# Altium schematic sheet Charger Interface - Relay Controls.SchDoc
size A4
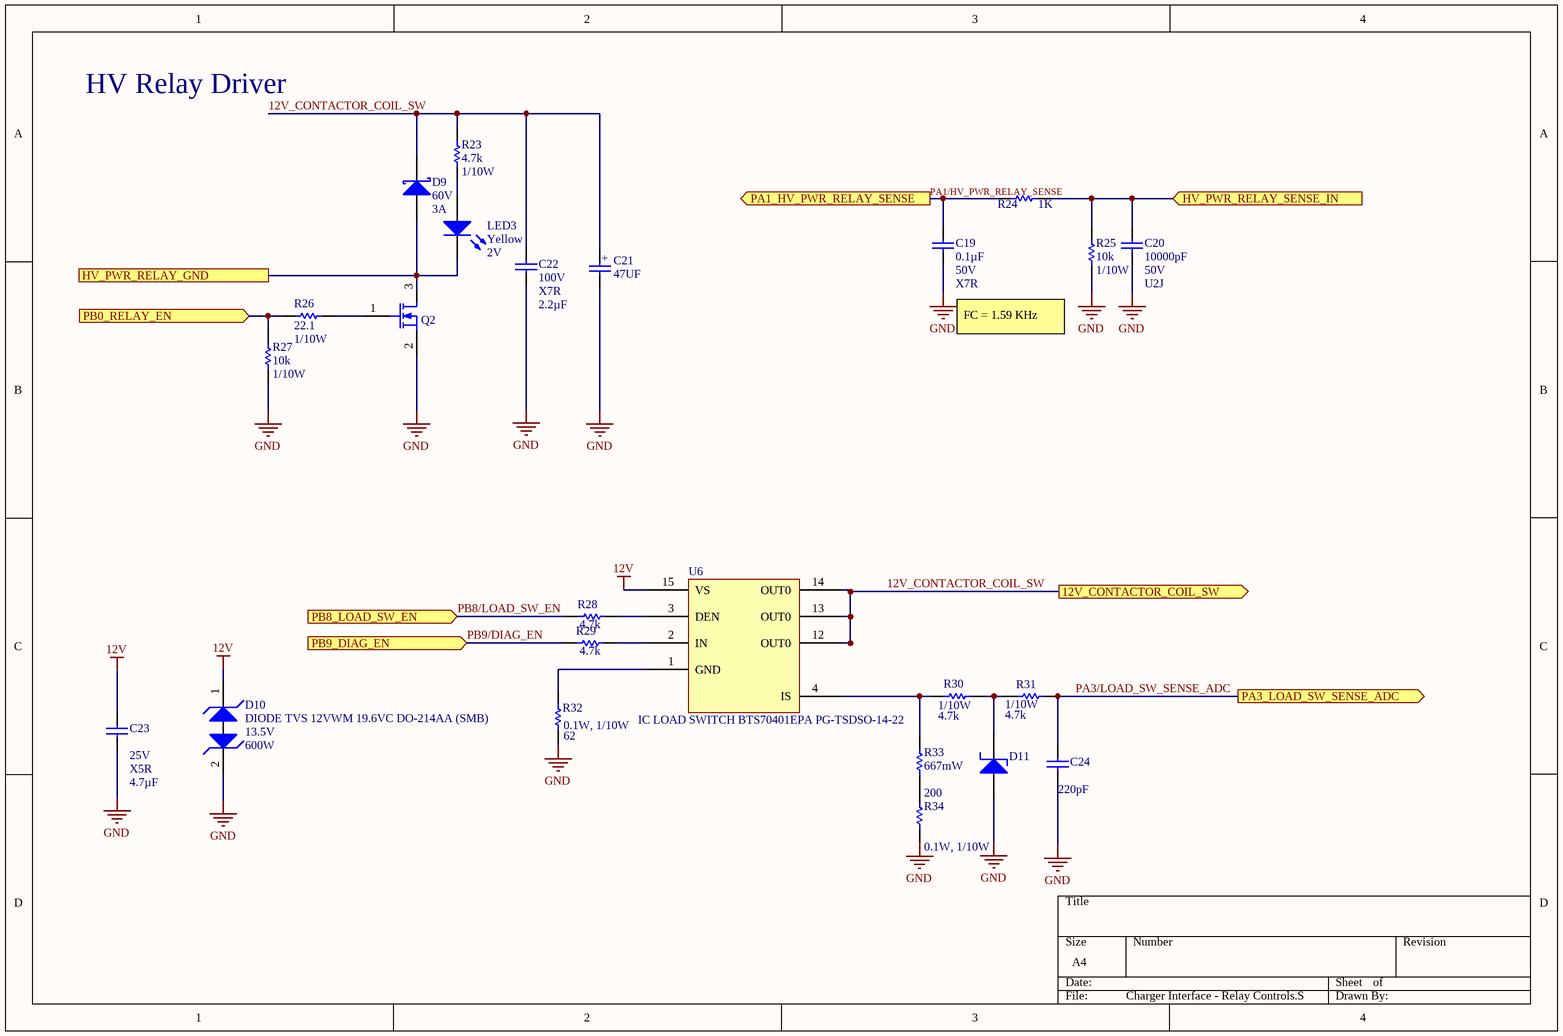
[diagram p0: Charger Interface - Relay Controls.SchDoc]

## Parts
C19  Capacitance: 0.1µF  Voltage: 50V  Temperature Coefficient: X7R  [CAP, 0603]  (hidden comment: CAP CER 0.1UF 50V 10% X7R 0603)
C20  Capacitance: 10000pF  Voltage: 50V  Temperature Coefficient: U2J  [CAP, 0603]  (hidden comment: CAP CER 10nF 50V 5% X7R 0603)
C21  47UF  [CAP ALUM 6.3MM RADIAL SMD]
C22  value 2.2µF  Voltage: 100V  Temperature Coefficient: X7R  [CAP, 1206]  (hidden comment: CAP CER 2.2UF 100V ±20% X7R 1206)
C23  value 4.7µF  Voltage: 25V  Temperature Coefficient: X5R  [CAP, 0603]  (hidden comment: CAP CER 4.7UF 25V 10% X5R 0603)
C24  value 220pF  [CAP, 0603]  (hidden comment: CAP CER 220PF 50V C0G/NP0 0603)
D9  Voltage - DC Reverse (Vr) (Max): 60V  Current - Average Rectified (Io): 3A  [Diode, SMA]  (hidden comment: DIODE SCHOTTKY 60V 3A SMA)
D10  DIODE TVS 12VWM 19.6VC DO-214AA (SMB)  Voltage - Breakdown (Min): 13.5V  Power - Peak Pulse: 600W  [DO-214AA Diode]
D11  DIODE ZENER 3.3V 200MW SOD323  [sod-323]  (value not drawn)
LED3  Color: Yellow  Voltage - Forward (Vf) (Typ): 2V  [LED_0603]  (hidden comment: LED YELLOW CLEAR 2.1V 0603)
Q2  MOSFET N-CH 30V 6.2A 0.9W SOT-23  [MOSFET N-CH 30V 6.2A 0.9W SOT-23]  (value not drawn)
R23  Resistance (Ohms): 4.7k  Power (Watts): 1/10W  [RES, 0603]  (hidden comment: RES 4.7K OHM 1% 1/10W 0603)
R24  1K  [RES, 0603]
R25  Resistance: 10k  Power: 1/10W  [RES, 0603]  (hidden comment: RES 10K OHM 1% 1/10W 0603)
R26  Resistance: 22.1  Power: 1/10W  [RES, 0603]  (hidden comment: RES 22.1 OHM 1% 1/10W 0603)
R27  Resistance: 10k  Power: 1/10W  [RES, 0603]  (hidden comment: RES 10K OHM 1% 1/10W 0603)
R28  Resistance (Ohms): 4.7k  [RES, 0603]  (hidden comment: RES 4.7K OHM 1% 1/10W 0603)
R29  Resistance (Ohms): 4.7k  [RES, 0603]  (hidden comment: RES 4.7K OHM 1% 1/10W 0603)
R30  Resistance (Ohms): 4.7k  Power (Watts): 1/10W  [RES, 0603]  (hidden comment: RES 4.7K OHM 1% 1/10W 0603)
R31  Resistance (Ohms): 4.7k  Power (Watts): 1/10W  [RES, 0603]  (hidden comment: RES 4.7K OHM 1% 1/10W 0603)
R32  value 62  Power (Watts): 0.1W, 1/10W  [RES, 0603]  (hidden comment: RES 62 OHM 0.1% 1/10W 0603)
R33  value 200  Max Power Dissipation: 667mW  [RES 1206]  (hidden comment: RES 200 OHM 5% 2/3W 1206)
R34  Power (Watts): 0.1W, 1/10W  [RES, 0603]  (hidden comment: RES 1K OHM 5% 1/10W 0603)
U6  IC LOAD SWITCH BTS70401EPA PG-TSDSO-14-22  [IC LOAD SWITCH PG-TSDSO-14-22]

## Ports
12V_CONTACTOR_COIL_SW (out), HV_PWR_RELAY_GND, HV_PWR_RELAY_SENSE_IN (in), PA1_HV_PWR_RELAY_SENSE (out), PA3_LOAD_SW_SENSE_ADC (out), PB0_RELAY_EN (in), PB8_LOAD_SW_EN (in), PB9_DIAG_EN (in)

## Nets
12V: C23.1 D10.1(Cathode1) U6.15(VS)
GND: C19.2 C20.2 C21.2 C22.2 C23.2 C24.2 D10.2(Cathode2) D11.1(A) Q2.2(S) R25.2 R27.2 R32.2 R34.2
12V_CONTACTOR_COIL_SW: C21.1 C22.1 D9.2 R23.1 U6.12(OUT0) U6.13(OUT0) U6.14(OUT0) ; port 12V_CONTACTOR_COIL_SW
HV_PWR_RELAY_GND: D9.1 LED3.2(K) Q2.3(D) ; port HV_PWR_RELAY_GND
HV_PWR_RELAY_SENSE_IN: C20.1 R24.2 R25.1 ; port HV_PWR_RELAY_SENSE_IN
PA1/HV_PWR_RELAY_SENSE: C19.1 R24.1 ; port PA1_HV_PWR_RELAY_SENSE
PA3/LOAD_SW_SENSE_ADC: C24.1 R31.2 ; port PA3_LOAD_SW_SENSE_ADC
PB0_RELAY_EN: R26.1 R27.1 ; port PB0_RELAY_EN
PB8/LOAD_SW_EN: R28.2 ; port PB8_LOAD_SW_EN
PB9/DIAG_EN: R29.2 ; port PB9_DIAG_EN
NetD11_2: D11.2(K) R30.2 R31.1
NetLED3_1: LED3.1(A) R23.2
NetQ2_1: Q2.1(G) R26.2
NetR28_1: R28.1 U6.3(DEN)
NetR29_1: R29.1 U6.2(IN)
NetR30_1: R30.1 R33.1 U6.4(IS)
NetR32_1: R32.1 U6.1(GND)
NetR33_2: R33.2 R34.1

## Notes on the sheet
- HV Relay Driver
- FC = 1.59 KHz
- (in symbol CAP ALUM 47UF 20% 35V SMD) +

## Library data of the parts
C19 = CAP CER 0.1UF 50V 10% X7R 0603: 0.10µF ±10% 50V Ceramic Capacitor X7R 0603 (1608 Metric); Manufacturer 1: AVX Corporation; Manufacturer Part Number 1: 06035C104KAT2A; Supplier 1: Digi-Key; Supplier Part Number 1: 478-5052-1-ND; Packaging: Cut Tape (CT); Part Status: Active; Operating Temperature: -55°C ~ 125°C; Ratings: -; Mounting Type: Surface Mount, MLCC; Package / Case: 0603 (1608 Metric); Size / Dimension: 0.063" L x 0.032" W (1.60mm x 0.81mm); Height - Seated (Max): -; Thickness (Max): 0.035" (0.90mm); Lead Spacing: -; Lead Style: -; ComponentLink1URL: http://datasheets.avx.com/X7RDielectric.pdf; ComponentLink1Description: http://datasheets.avx.com/X7RDielectric.pdf; Tolerance: ±10%
C20 = CAP CER 10nF 50V 5% X7R 0603: 10000pF ±5% 50V Ceramic Capacitor U2J 0603 (1608 Metric); Manufacturer 1: KEMET; Manufacturer Part Number 1: C0603C103J5JAC7867; Supplier 1: Digi-Key; Supplier Part Number 1: 399-13384-1-ND; Packaging: Cut Tape (CT); Part Status: Active; Operating Temperature: -55°C ~ 125°C; Ratings: -; Failure Rate: -; Mounting Type: Surface Mount, MLCC; Package / Case: 0603 (1608 Metric); Size / Dimension: 0.063" L x 0.032" W (1.60mm x 0.80mm); Height - Seated (Max): -; Thickness (Max): 0.034" (0.87mm); Lead Spacing: -; Lead Style: -; ComponentLink1URL: http://www.kemet.com/docfinder?Partnumber=C0603C103J5JAC7867; ComponentLink1Description: http://www.kemet.com/docfinder?Partnumber=C0603C103J5JAC7867; Tolerance: ±5%
C21 = CAP ALUM 47UF 20% 35V SMD: 47µF 35V Aluminum Electrolytic Capacitors Radial, Can - SMD 1000 Hrs @ 85°C; Manufacturer: Panasonic; Manufacturer Part Number: EEE-1VA470WP; Ripple Current: 70mA; Tolerance: 20%; Life (Hours): 1000Hour; Supplier 1: Digi-Key; Stock 1: 2820; Pricing 1: 1=0.38, 10=0.263, 100=0.1579, 500=0.11846 (USD); Mount: Surface Mount,PCB; Case/Package: Radial; Min Operating Temperature: -40°C; Max Operating Temperature: 85°C; Voltage Rating: 35V; Ripple Current (AC): 70mA; Packaging: Tape and Reel; Package Quantity: 1; Termination: SMD/SMT; Diameter: 6.3mm; Length: 5.5mm; Height: 5.4mm; Height - Seated (Max): 0.213inch; Radiation Hardening: No; REACH SVHC: Unknown; Lead Free: Lead Free; ComponentLink1URL: https://datasheet.ciiva.com/2983/aba0000ce2-2983926.pdf; ComponentLink1Description: https://datasheet.ciiva.com/2983/aba0000ce2-2983926.pdf; ComponentLink2URL: https://datasheet.ciiva.com/2983/aba0000ce2-2983927.pdf; ComponentLink2Description: https://datasheet.ciiva.com/2983/aba0000ce2-2983927.pdf; ComponentLink3URL: https://datasheet.ciiva.com/14598/70255710-14598937.pdf; ComponentLink3Description: https://datasheet.ciiva.com/14598/70255710-14598937.pdf; ComponentLink4URL: https://datasheet.ciiva.com/15165/getdatasheetpartid-86239-15165868.pdf; ComponentLink4Description: https://datasheet.ciiva.com/15165/getdatasheetpartid-86239-15165868.pdf; ComponentLink5URL: https://datasheet.ciiva.com/16507/aba0000ce2-16507965.pdf; ComponentLink5Description: https://datasheet.ciiva.com/16507/aba0000ce2-16507965.pdf; ComponentLink6URL: https://datasheet.ciiva.com/30206/11aba0000ce2-30206253.pdf; ComponentLink6Description: https://datasheet.ciiva.com/30206/11aba0000ce2-30206253.pdf; Capacitance: 47uF; Voltage Rating (DC): 35V; Contact Plating: Tin
C22 = CMP-013-0032-1: 2.2µF ±20% 100V Ceramic Capacitor X7R 1206 (3216 Metric); Manufacturer 1: Murata Electronics North America; Manufacturer Part Number 1: GRM31CR72A225MA73L; ComponentLink1URL: http://www.murata.com/~/media/webrenewal/support/library/catalog/products/capacitor/mlcc/c02e.ashx; Thickness (Max): 0.071" (1.80mm); Design Item ID: CAP CER 2.2UF 100V ±20% X7R 1206; Lead Spacing: -; Height - Seated (Max): -; Source: Schematic Diagrams.SchLib; Mounting Type: Surface Mount, MLCC; Tolerance: 20%; Package / Case: 1206 (3216 Metric); Operating Temperature: -55°C ~ 125°C; Lead Style: -; Ratings: -; Packaging: Cut Tape (CT); Part Status: Active; ComponentLink1Description: http://www.murata.com/~/media/webrenewal/support/library/catalog/products/capacitor/mlcc/c02e.ashx; Size / Dimension: 0.126" L x 0.063" W (3.20mm x 1.60mm)
C23 = CMP-013-0026-1: 4.7µF ±10% 25V Ceramic Capacitor X5R 0603 (1608 Metric); Manufacturer 1: Murata Electronics North America; Manufacturer Part Number 1: GRM188R61E475KE11D; Packaging: Cut Tape (CT); Thickness (Max): 0.031" (0.80mm); Size / Dimension: 0.063" L x 0.031" W (1.60mm x 0.80mm); ComponentLink1URL: http://www.murata.com/~/media/webrenewal/support/library/catalog/products/capacitor/mlcc/c02e.ashx; Height - Seated (Max): -; Tolerance: 10%; Package / Case: 0603 (1608 Metric); Operating Temperature: -55°C ~ 85°C; Part Status: Active; ComponentLink1Description: http://www.murata.com/~/media/webrenewal/support/library/catalog/products/capacitor/mlcc/c02e.ashx; Mounting Type: Surface Mount, MLCC; Design Item ID: CAP CER 4.7UF 25V 10% X5R 0603; Ratings: -; Lead Style: -; Source: Schematic Diagrams.SchLib; Lead Spacing: -
C24 = CMP-013-0062-1: 220pF ±5% 50V Ceramic Capacitor C0G, NP0 0603 (1608 Metric); Manufacturer Part Number: C0603C221J5GACAUTO; Manufacturer: KEMET; Dissipation Factor: 0.1%; Design Item ID: CAP CER 220PF 50V C0G/NP0 0603; REACH SVHC: No SVHC; Height: 0.8mm; ComponentLink2Description: https://datasheet.ciiva.com/22694/1633156-22694015.pdf?src-supplier=Element14; Max Operating Temperature: 125°C; Mount: Surface Mount; Voltage Rating: 50V; Contact Plating: Tin; Pricing 1: 1=0.14000, 10=0.09700, 100=0.04550, 500=0.03188, 1000=0.02640 (USD); Stock 1: 35170; Case/Package: 0603; Tolerance: 5%; Ratings: AEC-Q200; ComponentLink1Description: https://datasheet.ciiva.com/18192/getdatasheetpartid-416741-18192869.pdf?src-supplier=Verical; Voltage Rating (DC): 50V; ComponentLink1URL: https://datasheet.ciiva.com/18192/getdatasheetpartid-416741-18192869.pdf?src-supplier=Verical; Package Quantity: 1; Thickness: 0.034inch; Length: 1.6mm; Radiation Hardening: No; Depth: 0.8mm; Width: 0.031inch; Packaging: Tape and Reel; RoHS: Yes; Lead Free: Lead Free; ComponentLink2URL: https://datasheet.ciiva.com/22694/1633156-22694015.pdf?src-supplier=Element14; Termination: SMD/SMT; Min Operating Temperature: -55°C; Dielectric: C0G; Dielectric Material: Ceramic; Source: Schematic Diagrams.SchLib; Case Code (Metric): 1608
D9 = DIODE SCHOTTKY 60V 3A SMA: Diode Schottky 60V 3A Surface Mount SMA; Manufacturer 1: Diodes Incorporated; Manufacturer Part Number 1: B360A-13-F; Voltage - Forward (Vf) (Max) @ If: 700mV @ 3A; Speed: Fast Recovery =< 500ns, > 200mA (Io); Current - Reverse Leakage @ Vr: 500µA @ 60V; Capacitance @ Vr, F: 200pF @ 4V, 1MHz; Supplier 1: Digi-Key; Supplier Part Number 1: B360A-FDICT-ND; Packaging: Cut Tape (CT); Part Status: Active; Diode Type: Schottky; Mounting Type: Surface Mount; Package / Case: DO-214AC, SMA; Supplier Device Package: SMA; Operating Temperature - Junction: -55°C ~ 150°C; ComponentLink1URL: https://www.diodes.com/assets/Datasheets/ds30891.pdf; ComponentLink1Description: https://www.diodes.com/assets/Datasheets/ds30891.pdf
D10 = CMP-014-0012-1: TVS DIODE 12V 19.6V DO214AA; Manufacturer Part Number: SMBJ12CD-M3/H; Manufacturer: Vishay Semiconductor Diodes Division; Current - Peak Pulse (10/1000µs): 30.6A; Power Line Protection: No; Stock 1: 4469; Mounting Type: Surface Mount; Applications: General Purpose; RoHS: RoHS Compliant; ComponentLink1URL: http://www.vishay.com/docs/87606/87606.pdf; Voltage - Reverse Standoff (Typ): 12V; Supplier Device Package: DO-214AA (SMBJ); Voltage - Clamping (Max) @ Ipp: 19.6V; Part Status: Active; Source: Schematic Diagrams.SchLib; Packaging: Cut Tape (CT); Design Item ID: DIODE TVS 12VWM 19.6VC DO-214AA (SMB); Operating Temperature: -55°C ~ 150°C (TJ); ComponentLink1Description: http://www.vishay.com/docs/87606/87606.pdf; Capacitance @ Frequency: -; Pricing 1: 1=0.69, 10=0.565, 25=0.516, 100=0.3841, 250=0.34808 (CAD); Package / Case: DO-214AA, SMB
D11 = CMP-014-0022-1: Zener Diode 3.3V 200mW ±5% Surface Mount SOD-323; Voltage: 3.3V; Source: Schematic Diagrams.SchLib; ComponentLink1URL: http://www.vishay.com/docs/85764/bzx384.pdf; Design Item ID: DIODE ZENER 3.3V 200MW SOD323; ComponentLink1Description: http://www.vishay.com/docs/85764/bzx384.pdf
LED3 = LED YELLOW CLEAR 2.1V 0603: Yellow 590nm LED Indication - Discrete 2V 0603 (1608 Metric); Manufacturer: Wurth Electronics Inc.; Manufacturer Part Number: 150060YS75000; Lens Color: Colorless; Millicandela Rating: 120mcd; Lens Style/Size: Rectangle with Flat Top, 1.10mm x 0.70mm; Current - Test: 20mA; Viewing Angle: 140°; Wavelength - Peak: 595nm; Supplier 1: Digi-Key; RoHS: RoHS Compliant; Category: Optoelectronics; Stock 1: 10523; Pricing 1: 1=0.21, 100=0.1617, 500=0.13964 (CAD); Packaging: Cut Tape (CT); Part Status: Active; Lens Transparency: Clear; Mounting Type: Surface Mount; Wavelength - Dominant: 590nm; Features: -; Package / Case: 0603 (1608 Metric); Supplier Device Package: 0603; Size / Dimension: 1.60mm L x 0.80mm W; Height (Max): 0.80mm; ComponentLink1URL: http://katalog.we-online.de/led/datasheet/150060YS75000.pdf; ComponentLink1Description: http://katalog.we-online.de/led/datasheet/150060YS75000.pdf; Supplier Part Number 1: 732-4981-1-ND
Q2 = MOSFET N-CH 30V 6.2A 0.9W SOT-23: N-Channel 30V 6.2A (Ta) 900mW (Ta) Surface Mount SOT-23; Manufacturer: Diodes; Manufacturer Part Number: DMN3023L-7; Rds On Max: 25mR; Input Capacitance: 873pF; Supplier 1: Digi-Key; Stock 1: 38246; Pricing 1: 1=0.47, 10=0.368, 100=0.2529, 500=0.1734, 1000=0.1301 (USD); Mount: Surface Mount; Case/Package: TO-236-3; Min Operating Temperature: -55°C; Max Operating Temperature: 150°C; Packaging: Tape and Reel; Drain to Source Voltage (Vdss): 30V; Continuous Drain Current (ID): 6.2A; Max Power Dissipation: 900mW; ComponentLink1URL: https://www.diodes.com/assets/Datasheets/DMN3023L.pdf; ComponentLink1Description: https://www.diodes.com/assets/Datasheets/DMN3023L.pdf; ComponentLink2URL: http://www.mouser.com/ds/2/115/DMN3023L-959533.pdf; ComponentLink2Description: http://www.mouser.com/ds/2/115/DMN3023L-959533.pdf; Supplier Part Number 1: DMN3023L-7DICT-ND
R23 = RES 4.7K OHM 1% 1/10W 0603: 4.7k Ohm ±1% 0.1W, 1/10W Chip Resistor 0603 (1608 Metric) Moisture Resistant Thick Film; Manufacturer 1: Yageo; Manufacturer Part Number 1: RC0603FR-074K7L; Description 1: RES SMD 4.7K OHM 1% 1/10W 0603; Temperature Coefficient: ±100ppm/°C; Supplier 1: Digi-Key; Supplier Part Number 1: 311-4.70KHRCT-ND; RoHS: RoHS Compliant; Category: Resistors; Stock 1: 3487566; Pricing 1: 1=0.16, 10=0.022, 100=0.0089, 1000=0.00402, 2500=0.00349 (CAD); Packaging: Cut Tape (CT); Part Status: Active; Composition: Thick Film; Features: Moisture Resistant; Operating Temperature: -55°C ~ 155°C; Package / Case: 0603 (1608 Metric); Supplier Device Package: 0603; Size / Dimension: 0.063" L x 0.031" W (1.60mm x 0.80mm); Height - Seated (Max): 0.022" (0.55mm); Failure Rate: -; ComponentLink1URL: http://www.yageo.com/documents/recent/PYu-RC_Group_51_RoHS_L_7.pdf; ComponentLink1Description: http://www.yageo.com/documents/recent/PYu-RC_Group_51_RoHS_L_7.pdf; Tolerance: ±1%
R24 = RES 1K OHM 5% 1/10W 0603: 1k Ohm ±5% 0.1W, 1/10W Chip Resistor 0603 (1608 Metric); Manufacturer: Yageo; Manufacturer Part Number: RC0603JR-071KL; Temperature Coefficient: ±100ppm/°C; Supplier 1: Digi-Key; Supplier Part Number 1: 311-1.0KGRCT-ND; RoHS: RoHS Compliant; Category: Resistors; Stock 1: 4415240; Pricing 1: 1=0.15, 10=0.017, 100=0.0071, 1000=0.0032, 2500=0.00278 (CAD); Packaging: Cut Tape (CT); Part Status: Active; Resistance (Ohms): 1k; Tolerance: ±5%; Power (Watts): 0.1W, 1/10W; Composition: Thick Film; Features: Moisture Resistant; Operating Temperature: -55°C ~ 155°C; Package / Case: 0603 (1608 Metric); Supplier Device Package: 0603; Size / Dimension: 0.063" L x 0.031" W (1.60mm x 0.80mm); Height - Seated (Max): 0.022" (0.55mm); Failure Rate: -; ComponentLink1URL: http://www.yageo.com/documents/recent/PYu-RC_Group_51_RoHS_L_7.pdf; ComponentLink1Description: http://www.yageo.com/documents/recent/PYu-RC_Group_51_RoHS_L_7.pdf
R25 R27 = RES 10K OHM 1% 1/10W 0603: RES SMD 10K OHM 1% 1/10W 0603; Manufacturer 1: Yageo; Manufacturer Part Number 1: RC0603FR-0710KL; Temperature Coefficient: ±100ppm/°C; Supplier 1: Digi-Key; Supplier Part Number 1: 311-10.0KHRCT-ND; Packaging: Cut Tape (CT); Part Status: Active; Composition: Thick Film; Operating Temperature: -55°C ~ 155°C; Package / Case: 0603 (1608 Metric); Supplier Device Package: 0603; Size / Dimension: 0.063" L x 0.031" W (1.60mm x 0.80mm); Height - Seated (Max): 0.022" (0.55mm); Failure Rate: -; ComponentLink1URL: http://www.yageo.com/documents/recent/PYu-RC_Group_51_RoHS_L_7.pdf; ComponentLink1Description: http://www.yageo.com/documents/recent/PYu-RC_Group_51_RoHS_L_7.pdf; Tolerance: ±1%
R26 = RES 22.1 OHM 1% 1/10W 0603: 22.1 Ohm ±1% 0.1W, 1/10W Chip Resistor 0603 (1608 Metric) Moisture Resistant Thick Film; Manufacturer 1: Yageo; Manufacturer Part Number 1: RC0603FR-0722R1L; Temperature Coefficient: ±100ppm/°C; Supplier 1: Digi-Key; Supplier Part Number 1: 311-22.1HRCT-ND; Packaging: Cut Tape (CT); Part Status: Active; Composition: Thick Film; Operating Temperature: -55°C ~ 155°C; Package / Case: 0603 (1608 Metric); Supplier Device Package: 0603; Size / Dimension: 0.063" L x 0.031" W (1.60mm x 0.80mm); Height - Seated (Max): 0.022" (0.55mm); Failure Rate: -; ComponentLink1URL: http://www.yageo.com/documents/recent/PYu-RC_Group_51_RoHS_L_7.pdf; ComponentLink1Description: http://www.yageo.com/documents/recent/PYu-RC_Group_51_RoHS_L_7.pdf; Tolerance: ±1%
R28-R31 = CMP-010-0024-1: 4.7k Ohm ±1% 0.1W, 1/10W Chip Resistor 0603 (1608 Metric) Moisture Resistant Thick Film; Manufacturer Part Number 1: RC0603FR-074K7L; Manufacturer 1: Yageo; Temperature Coefficient: ±100ppm/°C; Description 1: RES SMD 4.7K OHM 1% 1/10W 0603; Stock 1: 3487566; Operating Temperature: -55°C ~ 155°C; ComponentLink1URL: http://www.yageo.com/documents/recent/PYu-RC_Group_51_RoHS_L_7.pdf; Composition: Thick Film; Pricing 1: 1=0.16, 10=0.022, 100=0.0089, 1000=0.00402, 2500=0.00349 (CAD); Size / Dimension: 0.063" L x 0.031" W (1.60mm x 0.80mm); Height - Seated (Max): 0.022" (0.55mm); Design Item ID: RES 4.7K OHM 1% 1/10W 0603; ComponentLink1Description: http://www.yageo.com/documents/recent/PYu-RC_Group_51_RoHS_L_7.pdf; Failure Rate: -; Features: Moisture Resistant; Supplier Device Package: 0603; Part Status: Active; Tolerance: 1%; RoHS: RoHS Compliant; Source: Schematic Diagrams.SchLib; Packaging: Cut Tape (CT); Package / Case: 0603 (1608 Metric)
  R28 R29: Power (Watts): 1/10W
R32 = CMP-010-0025-1: 62 Ohms ±0.1% 0.1W, 1/10W Chip Resistor 0603 (1608 Metric) Automotive AEC-Q200 Thin Film; Manufacturer Part Number: ERA-3AEB620V; Manufacturer: Panasonic Electronic Components; Temperature Coefficient: ±25ppm/°C; RoHS: RoHS Compliant; Operating Temperature: -55°C ~ 155°C; Failure Rate: -; Source: Schematic Diagrams.SchLib; Size / Dimension: 0.063" L x 0.032" W (1.60mm x 0.80mm); Height - Seated (Max): 0.022" (0.55mm); Composition: Thin Film; Features: Automotive AEC-Q200; Package / Case: 0603 (1608 Metric); Tolerance: 0.1%; Packaging: Cut Tape (CT); Supplier Device Package: 0603; Part Status: Active; ComponentLink1Description: https://industrial.panasonic.com/cdbs/www-data/pdf/RDM0000/AOA0000C307.pdf; Stock 1: 10320; ComponentLink1URL: https://industrial.panasonic.com/cdbs/www-data/pdf/RDM0000/AOA0000C307.pdf; Design Item ID: RES 62 OHM 0.1% 1/10W 0603; Pricing 1: 1=0.52, 10=0.447, 100=0.1748, 1000=0.07317, 2500=0.06708 (CAD)
R33 = CMP-010-0008-1: 200 Ohms ±5% 0.667W, 2/3W Chip Resistor 1206 (3216 Metric) Automotive AEC-Q200, Pulse Withstanding Thick Film; Manufacturer Part Number: ERJ-P08J201V; Manufacturer: Panasonic; Temperature Coefficient: 200ppm/°C; Voltage Rating (DC): 200V; Voltage Rating: 500V; Power Rating: 660mW; ComponentLink2URL: https://datasheet.ciiva.com/9184/aoa0000ce4-9184599.pdf; Source: Schematic Diagrams.SchLib; Tolerance: 5%; ComponentLink3URL: https://datasheet.ciiva.com/9184/aoa0000ce4-9184603.pdf; Min Operating Temperature: -55°C; Package Quantity: 1; Max Operating Temperature: 155°C; Case/Package: 1206; Number of Terminations: 2; Case Code (Metric): 3216; Lead Free: Contains Lead; Stock 1: 32165; Termination: SMD/SMT; ComponentLink2Description: https://datasheet.ciiva.com/9184/aoa0000ce4-9184599.pdf; ComponentLink1URL: https://datasheet.ciiva.com/17207/aoa0000ce4-17207029.pdf; ComponentLink3Description: https://datasheet.ciiva.com/9184/aoa0000ce4-9184603.pdf; ComponentLink4URL: https://datasheet.ciiva.com/30201/aoa0000ce4-30201485.pdf; Composition: Thick Film; Mount: Surface Mount; ComponentLink1Description: https://datasheet.ciiva.com/17207/aoa0000ce4-17207029.pdf; Packaging: Tape and Reel; Design Item ID: RES 200 OHM 5% 2/3W 1206; ComponentLink4Description: https://datasheet.ciiva.com/30201/aoa0000ce4-30201485.pdf; Pricing 1: 1=0.16, 10=0.137, 100=0.0534, 1000=0.02237, 2500=0.02051 (USD); Radiation Hardening: No; Contact Plating: Tin; Width: 1.6mm; Height: 0.028inch; Length: 3.2mm
R34 = CMP-010-0108-1: 1k Ohm ±5% 0.1W, 1/10W Chip Resistor 0603 (1608 Metric); Manufacturer: Yageo; Manufacturer Part Number: RC0603JR-071KL; Temperature Coefficient: ±100ppm/°C; Failure Rate: -; Package / Case: 0603 (1608 Metric); Tolerance: 5%; Features: Moisture Resistant; ComponentLink1URL: http://www.yageo.com/documents/recent/PYu-RC_Group_51_RoHS_L_7.pdf; ComponentLink1Description: http://www.yageo.com/documents/recent/PYu-RC_Group_51_RoHS_L_7.pdf; Design Item ID: RES 1K OHM 5% 1/10W 0603; Stock 1: 4415240; Part Status: Active; Pricing 1: 1=0.15, 10=0.017, 100=0.0071, 1000=0.0032, 2500=0.00278 (CAD); Height - Seated (Max): 0.022" (0.55mm); Source: Schematic Diagrams.SchLib; Supplier Device Package: 0603; RoHS: RoHS Compliant; Composition: Thick Film; Packaging: Cut Tape (CT); Operating Temperature: -55°C ~ 155°C; Resistance (Ohms): 1k; Size / Dimension: 0.063" L x 0.031" W (1.60mm x 0.80mm)
U6 = CMP-003-0154-4: Power Switch/Driver 1:1 N-Channel 4.5A PG-TSDSO-14-22; Manufacturer: Infineon; Manufacturer Part Number: BTS70401EPAXUMA1; Design Item ID: IC LOAD SWITCH BTS70401EPA PG-TSDSO-14-22; ComponentLink1Description: https://www.infineon.com/dgdl/Infineon-BTS7040-1EPA-DS-v01_00-EN.pdf?fileId=5546d462636cc8fb0163fe8f965308bc; ComponentLink1URL: https://www.infineon.com/dgdl/Infineon-BTS7040-1EPA-DS-v01_00-EN.pdf?fileId=5546d462636cc8fb0163fe8f965308bc; Source: Schematic Diagrams.SchLib